# EAGLE design Zio Qwiic Mux (EAGLE 8.6.1)
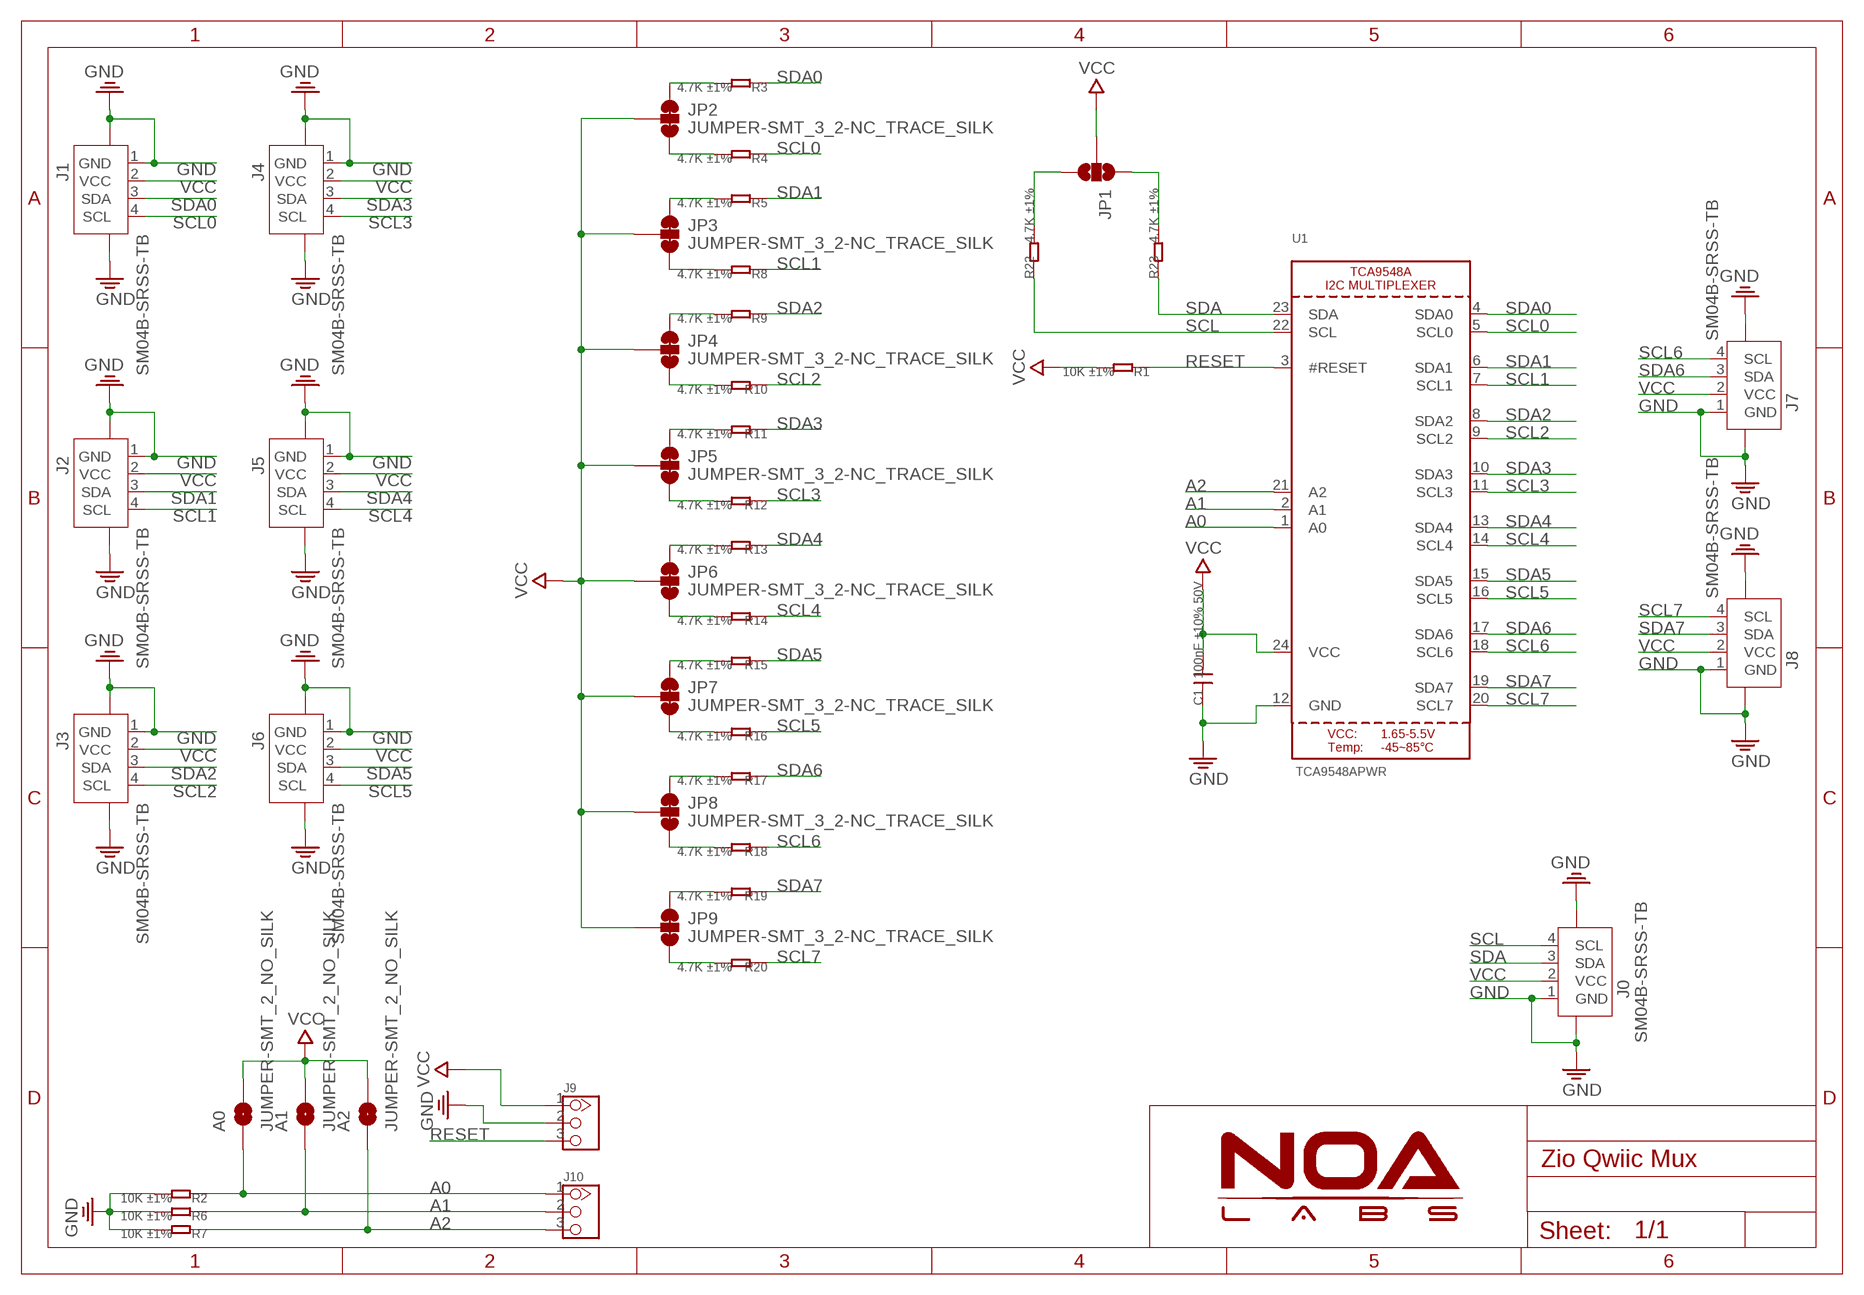
[diagram p0: schematic, sheet 1]

## Parts
A0  JUMPER-SMT_2_NO_SILK  [SMT-JUMPER_2_NO_SILK]
A1  JUMPER-SMT_2_NO_SILK  [SMT-JUMPER_2_NO_SILK]
A2  JUMPER-SMT_2_NO_SILK  [SMT-JUMPER_2_NO_SILK]
C1  100nF ±10% 50V  C-0603  [0603]
J0  SM04B-SRSS-TB  JST-SH-4P-1.0  [JST-SH-4P]
J1  SM04B-SRSS-TB  JST-SH-4P-1.0  [JST-SH-4P]
J2  SM04B-SRSS-TB  JST-SH-4P-1.0  [JST-SH-4P]
J3  SM04B-SRSS-TB  JST-SH-4P-1.0  [JST-SH-4P]
J4  SM04B-SRSS-TB  JST-SH-4P-1.0  [JST-SH-4P]
J5  SM04B-SRSS-TB  JST-SH-4P-1.0  [JST-SH-4P]
J6  SM04B-SRSS-TB  JST-SH-4P-1.0  [JST-SH-4P]
J7  SM04B-SRSS-TB  JST-SH-4P-1.0  [JST-SH-4P]
J8  SM04B-SRSS-TB  JST-SH-4P-1.0  [JST-SH-4P]
J9  HEADER-3P-2.54  [3P-2.54]
J10  HEADER-3P-2.54  [3P-2.54]
JP1  JUMPER-SMT_3_2-NC_PASTE_NOCREM  [SMT-JUMPER_3_2-NC_PASTE_SILK_NOCREM]
JP2  JUMPER-SMT_3_2-NC_TRACE_SILK  [SMT-JUMPER_3_2-NC_TRACE_SILK]
JP3  JUMPER-SMT_3_2-NC_TRACE_SILK  [SMT-JUMPER_3_2-NC_TRACE_SILK]
JP4  JUMPER-SMT_3_2-NC_TRACE_SILK  [SMT-JUMPER_3_2-NC_TRACE_SILK]
JP5  JUMPER-SMT_3_2-NC_TRACE_SILK  [SMT-JUMPER_3_2-NC_TRACE_SILK]
JP6  JUMPER-SMT_3_2-NC_TRACE_SILK  [SMT-JUMPER_3_2-NC_TRACE_SILK]
JP7  JUMPER-SMT_3_2-NC_TRACE_SILK  [SMT-JUMPER_3_2-NC_TRACE_SILK]
JP8  JUMPER-SMT_3_2-NC_TRACE_SILK  [SMT-JUMPER_3_2-NC_TRACE_SILK]
JP9  JUMPER-SMT_3_2-NC_TRACE_SILK  [SMT-JUMPER_3_2-NC_TRACE_SILK]
R1  10K ±1%  R-0402  [0402]
R2  10K ±1%  R-0402  [0402]
R3  4.7K ±1%  R-0402  [0402]
R4  4.7K ±1%  R-0402  [0402]
R5  4.7K ±1%  R-0402  [0402]
R6  10K ±1%  R-0402  [0402]
R7  10K ±1%  R-0402  [0402]
R8  4.7K ±1%  R-0402  [0402]
R9  4.7K ±1%  R-0402  [0402]
R10  4.7K ±1%  R-0402  [0402]
R11  4.7K ±1%  R-0402  [0402]
R12  4.7K ±1%  R-0402  [0402]
R13  4.7K ±1%  R-0402  [0402]
R14  4.7K ±1%  R-0402  [0402]
R15  4.7K ±1%  R-0402  [0402]
R16  4.7K ±1%  R-0402  [0402]
R17  4.7K ±1%  R-0402  [0402]
R18  4.7K ±1%  R-0402  [0402]
R19  4.7K ±1%  R-0402  [0402]
R20  4.7K ±1%  R-0402  [0402]
R22  4.7K ±1%  R-0402  [0402]
R23  4.7K ±1%  R-0402  [0402]
U1  TCA9548APWR  TCA9548A  [TSSOP24]

## Nets
A0: A0.1 J10.1 R2.1 U1.1(A0)
A1: A1.1 J10.2 R6.1 U1.2(A1)
A2: A2.1 J10.3 R7.1 U1.21(A2)
GND: C1.1 J0.1(GND) J0.NC1 J0.NC2 J1.1(GND) J1.NC1 J1.NC2 J2.1(GND) J2.NC1 J2.NC2 J3.1(GND) J3.NC1 J3.NC2 J4.1(GND) J4.NC1 J4.NC2 J5.1(GND) J5.NC1 J5.NC2 J6.1(GND) J6.NC1 J6.NC2 J7.1(GND) J7.NC1 J7.NC2 J8.1(GND) J8.NC1 J8.NC2 J9.2 R2.2 R6.2 R7.2 U1.12(GND)
N$2: JP2.1 R3.2
N$3: JP2.3 R4.2
N$7: JP3.1 R5.2
N$8: JP3.3 R8.2
N$11: JP4.1 R9.2
N$13: JP4.3 R10.2
N$14: JP5.1 R11.2
N$17: JP5.3 R12.2
N$19: JP1.3 R22.2
N$20: JP1.1 R23.2
N$21: JP6.1 R13.2
N$23: JP6.3 R14.2
N$25: JP7.1 R15.2
N$26: JP7.3 R16.2
N$29: JP8.1 R17.2
N$30: JP8.3 R18.2
N$33: JP9.1 R19.2
N$34: JP9.3 R20.2
RESET: J9.3 R1.1 U1.3(#RESET)
SCL: J0.4(SCL) R22.1 U1.22(SCL)
SCL0: J1.4(SCL) R4.1 U1.5(SCL0)
SCL1: J2.4(SCL) R8.1 U1.7(SCL1)
SCL2: J3.4(SCL) R10.1 U1.9(SCL2)
SCL3: J4.4(SCL) R12.1 U1.11(SCL3)
SCL4: J5.4(SCL) R14.1 U1.14(SCL4)
SCL5: J6.4(SCL) R16.1 U1.16(SCL5)
SCL6: J7.4(SCL) R18.1 U1.18(SCL6)
SCL7: J8.4(SCL) R20.1 U1.20(SCL7)
SDA: J0.3(SDA) R23.1 U1.23(SDA)
SDA0: J1.3(SDA) R3.1 U1.4(SDA0)
SDA1: J2.3(SDA) R5.1 U1.6(SDA1)
SDA2: J3.3(SDA) R9.1 U1.8(SDA2)
SDA3: J4.3(SDA) R11.1 U1.10(SDA3)
SDA4: J5.3(SDA) R13.1 U1.13(SDA4)
SDA5: J6.3(SDA) R15.1 U1.15(SDA5)
SDA6: J7.3(SDA) R17.1 U1.17(SDA6)
SDA7: J8.3(SDA) R19.1 U1.19(SDA7)
VCC [power]: A0.2 A1.2 A2.2 C1.2 J0.2(VCC) J1.2(VCC) J2.2(VCC) J3.2(VCC) J4.2(VCC) J5.2(VCC) J6.2(VCC) J7.2(VCC) J8.2(VCC) J9.1 JP1.2 JP2.2 JP3.2 JP4.2 JP5.2 JP6.2 JP7.2 JP8.2 JP9.2 R1.2 U1.24(VCC)

## Library data of the parts
A0 A1 A2 = SparkFun-Jumpers:JUMPER-SMT_2_NO: Normally open jumper This jumper has two pads in close proximity to each other. Apply solder to close the connection. Round pads are easier to solder for beginners, but are a lot larger. SparkFun Product that uses the round pads: SparkFun EL Sequencer <https://www.sparkfun.com/products/12781>
C1 = Discretex:C*: Ceramic Capacitors
J0 J1-J8 = Connector:JST-SH-4P
J9 J10 = Connector:HEADER-3P
JP1 = NOA-Jumpers:JUMPER-SMT_3_2-NC_PASTE_NOCREM
JP2-JP9 = SparkFun-Jumpers:JUMPER-SMT_3_2-NC_TRACE: Normally closed trace jumper (2 of 2 connections) This jumper has a trace between all three pads so they are normally closed (NC). Use a razor knife to open the connection(s). For best results follow the IPC guidelines for cutting traces: Cutout at least 0.063 mm (0.005 in). Remove all loose material to clean up the cut area. Seal the cut with an approved epoxy. Reapply solder to reclose the connection(s).
R1-R20 R22 R23 = Discretex:R*
U1 = microbuilder:TCA9548A: TCA9548A I2C Multiplexer

## Board
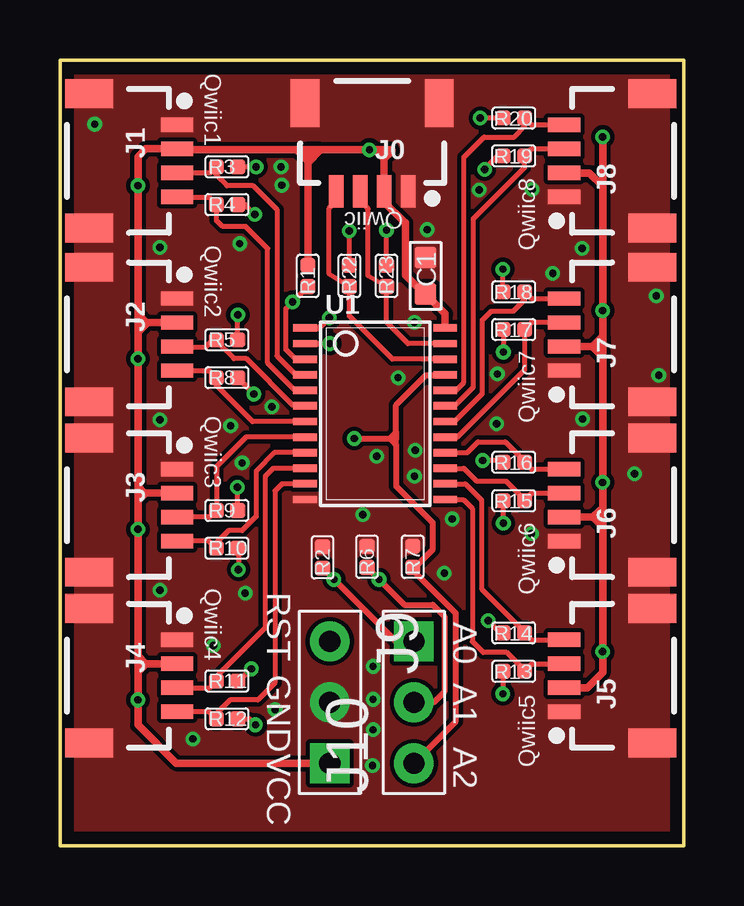
[diagram p1: board, top side]
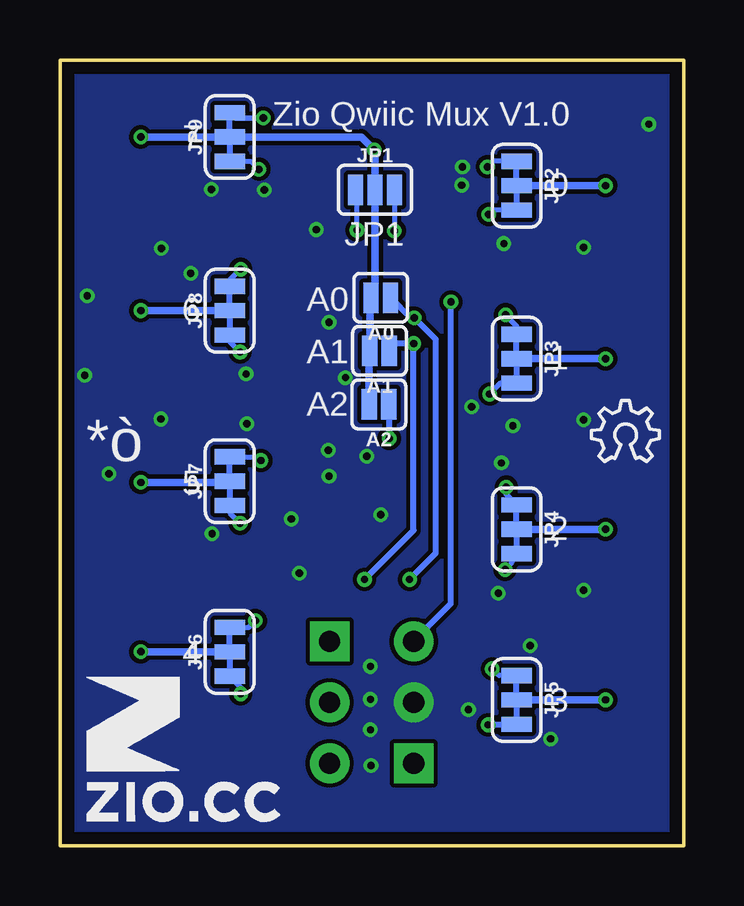
[diagram p2: board, bottom side, seen from below]

Size 26 x 32.75 mm. Coordinates in mm from the lower left corner, seen from the top.
Outline: 0,0 0,32.75 26,32.75 26,0 0,0
Copper layers (1*16): Top 0.035mm / dielectric 1.5mm / Bottom 0.035mm
Design rules "NOA Eagle Rule": minimum track width 7mil, minimum drill 12mil, track to track 7mil, track to pad 7mil, pad to pad 7mil, via to via 7mil, smd to smd 0mil, copper to edge 20mil, drill to drill 10mil, minimum pad ring 10mil, minimum via ring 6mil, stop-mask expansion 2mil, vias tented up to drill 25mil, thermal gap 10mil

### Footprints (pad centres in the part's own frame; a part is rotated, then mirrored left to right if it is on the bottom)
SMT-JUMPER_2_NO_SILK = smd 0.635 x 1.27: 1 -0.406,0; 2 0.406,0
0603 = smd 0.889 x 0.889: 1 -0.762,0; 2 0.762,0
JST-SH-4P = smd 0.6 x 1.35: 1 1.5,0; 2 0.5,0; 3 -0.5,0; 4 -1.5,0 | smd 1.2 x 2: NC1 -2.8,3.675; NC2 2.8,3.675
3P-2.54 = drill 0.889 pad 1.651 square: 1 0,2.54 | drill 0.889 pad 1.651: 2 0,0; 3 0,-2.54
SMT-JUMPER_3_2-NC_PASTE_SILK_NOCREM = smd 0.635 x 1.27: 1 -0.813,0; 2 0,0; 3 0.813,0
SMT-JUMPER_3_2-NC_TRACE_SILK = smd 0.635 x 1.27: 1 -1.016,0; 2 0,0; 3 1.016,0
0402 = smd 0.635 x 0.635: 1 -0.445,0; 2 0.445,0
TSSOP24 = smd 0.305 x 0.991: 1 -3.575,-2.918; 2 -2.925,-2.918; 3 -2.275,-2.918; 4 -1.625,-2.918; 5 -0.975,-2.918; 6 -0.325,-2.918; 7 0.325,-2.918; 8 0.975,-2.918; 9 1.625,-2.918; 10 2.275,-2.918; 11 2.925,-2.918; 12 3.575,-2.918; 13 3.575,2.918; 14 2.925,2.918; 15 2.275,2.918; 16 1.625,2.918; 17 0.975,2.918; 18 0.325,2.918; 19 -0.325,2.918; 20 -0.975,2.918; 21 -1.625,2.918; 22 -2.275,2.918; 23 -2.925,2.918; 24 -3.575,2.918

### Placement (x,y rotation side)
A0  12.62,22.83 180 bottom
A1  12.67,20.62 180 bottom
A2  12.7,18.39 180 bottom
C1  15.24,23.75 270 top
J0  13.01,27.27 0 top
J1  4.88,28.54 90 top
J2  4.88,21.3 90 top
J3  4.88,14.19 90 top
J4  4.88,7.08 90 top
J5  21.01,7.08 270 top
J6  21.01,14.19 270 top
J7  21.01,21.3 270 top
J8  21.01,28.54 270 top
J9  11.25,5.97 180 top
J10  14.76,5.97 0 top
JP1  12.87,27.34 0 bottom
JP2  6.96,27.51 270 bottom
JP3  6.96,20.29 270 bottom
JP4  6.96,13.18 270 bottom
JP5  6.96,6.07 270 bottom
JP6  18.92,8.08 90 bottom
JP7  18.92,15.19 90 bottom
JP8  18.92,22.3 90 bottom
JP9  18.92,29.54 90 bottom
R1  10.34,23.75 90 top
R2  10.95,12.01 90 top
R3  6.96,28.3 0 top
R4  6.96,26.72 0 top
R5  6.96,21.08 0 top
R6  12.8,12.04 90 top
R7  14.71,12.04 90 top
R8  6.96,19.51 0 top
R9  6.96,13.97 0 top
R10  6.96,12.4 0 top
R11  6.96,6.86 0 top
R12  6.96,5.28 0 top
R13  18.92,7.26 180 top
R14  18.92,8.86 180 top
R15  18.92,14.38 180 top
R16  18.92,15.98 180 top
R17  18.92,21.51 180 top
R18  18.92,23.09 180 top
R19  18.92,28.75 180 top
R20  18.92,30.33 180 top
R22  12.06,23.75 90 top
R23  13.61,23.75 90 top
U1  13.14,18 270 top
U$7  [6MM]  24.92,1.02 0 bottom
U$8  [OSHW_6X100_NOTEXT]  3.84,16 0 bottom

### Tracks (layer width: path | path; a pad name or v marks a point on that pad's centre or on a via)
A0  (via drill 0.3)
  Top 0.203: 9.87,21.58 U1.1
  Top 0.254: J10.1 14.01,8.51 v11.42,11.09 R2.1 | U1.1 10.81,21.58 v11.23,22
  Bottom 0.254: A0.1 11.38,22 v11.23,22 10.34,21.11 10.34,12.18 v11.42,11.09
A1  (via drill 0.3)
  Top 0.254: J10.2 15.6,5.97 16.03,6.4 16.03,9.55 15.54,10.03 14.36,10.03 v13.3,11.09 R6.1 | U1.2 v11.25,20.93
  Bottom 0.254: A1.1 11.96,20.93 v11.25,20.93 11.25,13.14 v13.3,11.09
A2  (via drill 0.3)
  Top 0.203: R7.1 14.8,11.6 | 15.54,13.46 15.52,13.49
  Top 0.254: J10.3 16.51,5.18 16.51,9.68 14.91,11.28 R7.1 | U1.21 16.04,19.61 15.27,19.61 14.02,18.36 14.02,17.22 | 15.52,13.49 14.02,14.99 14.02,16.66 | 14.02,16.66 14.02,16.97 | 14.02,17.22 14.02,16.97 | 14.8,11.6 15.54,12.34 15.54,13.46 | v12.27,16.97 13.77,16.97 | 13.77,16.97 14.02,16.97 | 13.77,16.97 14.02,17.22 | 13.77,16.97 14.02,16.71 14.02,16.66
  Bottom 0.203: 12.27,18.36 A2.1
  Bottom 0.254: v12.27,16.97 12.27,18.36
GND  (via drill 0.3)
  other vias: 1.45,30.07 14.1,19.51 14.78,21.82 24.87,22.91 24.97,19.61 21.79,17.78 19.66,13 21.77,24.89 4.17,24.94 4.17,17.75 4.17,10.64 15.32,25.68 12.62,13.79 13.06,4.83 13.06,7.47 14.78,15.39 14.81,16.48 23.95,15.49 16.36,13.61 16.03,11.35 13.03,3.33 13.06,6.1 9.22,28.3 9.25,27.53 7.49,25.1 7.59,15.95 8.84,18.29 7.11,17.5 6.4,8.33 8.97,5.66 5.54,4.45 13.21,16.23 18.21,17.58 18.24,19.66 20.55,23.85 17.48,27.33 19.68,27.36 7.72,10.52
  pour Bottom (no thermals): -0.03,32.74 26.01,32.74 26.01,0 -0.03,0
  pour Top (no thermals): 0,32.74 25.98,32.74 25.98,0 0,0
N$2  (via drill 0.3)
  Top 0.203: R3.2 v8.18,28.3
  Bottom 0.203: JP2.1 7.95,28.52 v8.18,28.3
N$3  (via drill 0.3)
  Top 0.203: R4.2 7.72,26.72 v8.13,26.31
  Bottom 0.203: JP2.3 7.95,26.49 v8.13,26.31
N$7  (via drill 0.3)
  Top 0.203: R5.2 7.4,22.11 v7.42,22.12
  Bottom 0.203: JP3.1 6.96,21.67 v7.42,22.12
N$8  (via drill 0.3)
  Top 0.203: R8.2 8.08,18.83 v8.08,18.82
  Bottom 0.203: JP3.3 7.64,19.28 8.08,18.85 v8.08,18.82
N$11  (via drill 0.3)
  Top 0.203: R9.2 7.4,14.92 v7.39,14.94
  Bottom 0.203: 7.39,14.63 v7.39,14.94 7.39,14.63 | 7.39,14.63 7.25,14.49 | JP4.1 7.39,14.63
N$13  (via drill 0.3)
  Top 0.203: R10.2 7.44,12.36 v7.44,11.51
  Bottom 0.203: v7.44,11.51 7.16,11.79 7.16,11.97 JP4.3
N$14  (via drill 0.3)
  Top 0.203: R11.2 7.47,6.86 v7.98,7.37
  Bottom 0.203: JP5.1 7.7,7.09 v7.98,7.37
N$17  (via drill 0.3)
  Top 0.203: R12.2 7.9,5.28 v8.15,5.03
  Bottom 0.203: 7.37,5.03 v8.15,5.03 8.13,5.05 JP5.3
N$19  (via drill 0.3)
  Top 0.203: R22.2 v12.06,25.63
  Bottom 0.203: JP1.3 v12.05,25.64 v12.06,25.63
N$20  (via drill 0.3)
  Top 0.203: R23.2 v13.61,25.65
  Bottom 0.203: v13.61,25.65 13.61,27.27 JP1.1
N$21  (via drill 0.3)
  Top 0.203: R13.2 18.48,6.34 v18.47,6.33
  Bottom 0.203: JP6.1 18.47,6.6 v18.47,6.33
N$23  (via drill 0.3)
  Top 0.203: R14.2 18.36,8.87 v17.86,9.37
  Bottom 0.203: JP6.3 18.14,9.09 v17.86,9.37
N$25  (via drill 0.3)
  Top 0.203: R15.2 18.48,13.45 v18.49,13.44
  Bottom 0.203: JP7.1 18.92,13.87 v18.49,13.44
N$26  (via drill 0.3)
  Top 0.203: R16.2 18.4,16.05 v17.63,16.05
  Bottom 0.203: JP7.3 17.78,16.2 v17.63,16.05
N$29  (via drill 0.3)
  Top 0.203: R17.2 v18.49,20.57
  Bottom 0.203: JP8.1 18.92,21.01 v18.49,20.57
N$30  (via drill 0.3)
  Top 0.203: R18.2 18.48,24.02 v18.47,24.03
  Bottom 0.203: JP8.3 18.92,23.57 v18.47,24.03
N$33  (via drill 0.3)
  Top 0.203: R19.2 18.26,28.75 v17.7,28.19
  Bottom 0.203: JP9.1 18.03,28.52 v17.7,28.19
N$34  (via drill 0.3)
  Top 0.203: R20.2 v17.53,30.33
  Bottom 0.203: 18.52,30.33 v17.53,30.33 18.69,30.33 JP9.3
RESET  (via drill 0.3)
  Top 0.203: U1.3 9.82,20.28 9.42,20.68 9.42,22.39 v9.7,22.66 R1.1
  Bottom 0.254: J9.3 11.25,8.53 9.7,10.08 v9.7,22.66
SCL
  Top 0.203: U1.22 13.86,20.28 12.06,22.07 R22.1 11.23,23.82 11.23,26.57 11.51,26.86 J0.4
SCL0
  Top 0.203: J1.4 4.96,26.97 5.01,27.03 6.21,27.03 R4.1 6.51,26.07 6.78,25.81 7.75,25.81 8.66,24.89 8.66,20.12 9.8,18.98 U1.5
SCL1
  Top 0.203: U1.7 8.03,17.68 6.51,19.19 R8.1 6.24,19.79 4.9,19.79 J2.4
SCL2
  Top 0.203: J3.4 4.9,12.71 6.21,12.71 R10.1 6.51,12.61 7.04,13.13 7.59,13.13 8.18,13.72 8.18,15.62 8.94,16.38 U1.9
SCL3
  Top 0.203: J4.4 6.22,5.58 R12.1 6.51,5.5 7.09,6.07 8.26,6.07 8.97,6.78 8.97,14.78 9.26,15.08 U1.11
SCL4
  Top 0.203: U1.14 16.9,15.08 17.58,14.4 17.58,10.7 19.37,8.91 R14.1 19.65,8.58 J5.4
  Top 0.254: J5.4 20.58,8.58
SCL5
  Top 0.203: U1.16 16.99,16.38 17.44,16.83 18.57,16.83 19.34,16.06 19.34,16.01 R16.1 19.65,15.69 J6.4
  Top 0.254: J6.4 20.63,15.69
SCL6
  Top 0.203: J7.4 19.65,22.8 R18.1 19.37,22.75 18.9,22.28 17.98,22.28 17.6,21.89 17.6,18.83 16.45,17.68 U1.18
SCL7
  Top 0.203: U1.20 16.51,18.98 16.84,19.3 16.84,28.7 17.68,29.54 18.95,29.54 19.37,29.96 R20.1 19.65,30.04 J8.4
SDA
  Top 0.203: U1.23 14.51,20.93 13.61,21.82 R23.1 12.85,23.75 12.85,26.54 12.51,26.88 J0.3
SDA0
  Top 0.203: U1.4 9.82,19.63 9.04,20.41 9.04,26.52 8.05,27.51 6.96,27.51 6.51,27.95 R3.1 | 4.91,28.02 J1.3 6.26,28.04 R3.1 | R3.1 6.51,28.4
SDA1
  Top 0.203: 10.21,18.31 U1.6 | U1.6 9.82,18.33 | J2.3 4.91,20.78 6.07,20.78 6.33,21.03 6.51,21.03 | U1.6 9.74,18.33 7.77,20.3 7.25,20.3 6.51,21.03 | 6.51,21.03 R5.1
SDA2
  Top 0.203: J3.3 6.24,13.69 R9.1 6.53,13.98 6.53,15.8 7.76,17.03 U1.8
SDA3
  Top 0.203: J4.3 4.91,6.55 6.21,6.55 R11.1 6.51,7.02 8.56,9.07 8.56,15.39 8.89,15.72 U1.10
SDA4
  Top 0.203: J5.3 19.67,7.57 R13.1 19.3,7.33 19.3,7.38 18.63,8.05 17.65,8.05 17.2,8.51 17.2,14.05 16.82,14.43 U1.13
  Top 0.254: J5.3
SDA5
  Top 0.203: U1.15 16.84,15.73 17.37,15.19 18.6,15.19 19.2,14.6 19.2,14.55 R15.1 19.68,14.69 J6.3
  Top 0.254: J6.3
SDA6
  Top 0.203: U1.17 16.57,17.03 19.38,19.84 R17.1 19.66,21.8 J7.3
SDA7
  Top 0.203: J8.3 19.66,29.04 R19.1 19.37,28.26 17.22,26.11 17.22,19.1 16.45,18.33 U1.19
VCC  (via drill 0.3)
  Top 0.305: U1.24 16.06,22.17 C1.2 15.19,22.99 14.4,23.77 14.4,25.96 14.38,25.96 13.51,26.83 J0.2 13.51,28.63 | J8.2 22.07,28.04 22.63,27.48 | 22.63,13.99 22.63,13.69 | 22.63,20.37 22.63,20.8 | 22.63,20.37 v22.63,15.14 22.63,13.99 | 22.63,21.23 22.63,20.8 | 22.63,21.23 v22.63,22.3 22.63,27.48 | 22.63,13.28 22.63,13.69 | 22.63,13.28 v22.63,8.08 22.63,7.21 22,6.58 J5.2 | J6.2 22.23,13.69 | 22.23,13.69 22.63,13.69 | 22.23,13.69 22.53,13.99 22.63,13.99 | 22.23,13.69 22.63,13.28 | J7.2 22.2,20.8 | 22.2,20.8 22.63,20.8 | 22.2,20.8 22.63,21.23 | 22.2,20.8 22.63,20.37 | 3.25,14.38 3.25,14.68 | 3.25,14.96 3.25,14.68 | 3.25,21.4 3.25,21.79 | 3.25,21.4 v3.25,20.3 3.25,14.96 | 3.25,22.15 3.25,21.79 | 3.25,22.15 v3.25,27.51 3.25,28.73 3.57,29.04 J1.2 4.92,29.01 9.86,29.01 | J3.2 3.57,14.69 | 3.52,14.69 3.26,14.69 3.25,14.68 | 3.57,14.69 3.52,14.69 | 3.52,14.69 3.25,14.96 | 3.57,14.69 3.25,14.38 | 3.66,21.8 J2.2 | 3.6,21.8 3.26,21.8 3.25,21.79 | 3.66,21.8 3.6,21.8 | 3.6,21.8 3.25,22.15 | 3.66,21.8 3.25,21.4 | 10.87,29.01 10.29,29.01 | 10.87,29.01 12.75,29.01 | 9.86,29.01 10.29,29.01 | 3.25,7.54 3.29,7.58 3.57,7.58 | J4.2 3.59,7.58 | 3.25,7.9 3.25,7.54 | 3.25,7.9 v3.25,13.18 3.25,14.38 | 3.25,7.24 3.25,7.54 | 3.25,7.24 v3.25,6.07 3.25,5.03 4.85,3.43 J9.1 | 3.59,7.58 3.57,7.58 | 3.57,7.58 3.25,7.9 | 3.59,7.58 3.25,7.24 | 22.63,27.48 v22.63,29.54 | 12.76,29 12.75,29.01 | 13.13,29.01 13.56,29.01 | 13.13,29.01 v12.9,29.01 12.75,29.01 | 13.56,29.01 13.84,29.01 13.84,28.96 13.51,28.63 | 13.56,29.01 13.51,28.96 13.51,28.63 | 13.51,28.63 13.13,29.01 | R1.2 10.34,28.47 | 10.34,28.52 10.34,28.96 10.29,29.01 | 10.34,28.47 10.34,28.52 | 10.34,28.52 9.86,29.01 | 10.34,28.47 10.87,29.01
  Bottom 0.305: v22.63,29.54 JP9.2 13.44,29.54 v12.9,29.01 12.87,28.97 JP1.2 12.87,23 A0.2 13.08,22.78 A1.2 13.11,20.6 A2.2 | JP8.2 v22.63,22.3 | JP7.2 18.97,15.14 v22.63,15.14 | JP6.2 v22.63,8.08 | JP5.2 v3.25,6.07 | JP4.2 v3.25,13.18 | JP3.2 v3.25,20.3 | JP2.2 v3.25,27.51

### Text on the board
tPlace: Qwiic1 | Qwiic | Qwiic2 | Qwiic8 | Qwiic3 | Qwiic7 | Qwiic4 | RST | Qwiic6 | A0 | GND | A1 | VCC | A2 | Qwiic5
bPlace: Zio Qwiic Mux V1.0 | 7 | 0 | JP1 | A0 | 6 | A1 | 1 | A2 | 5 | *ò | 2 | 4 | 3